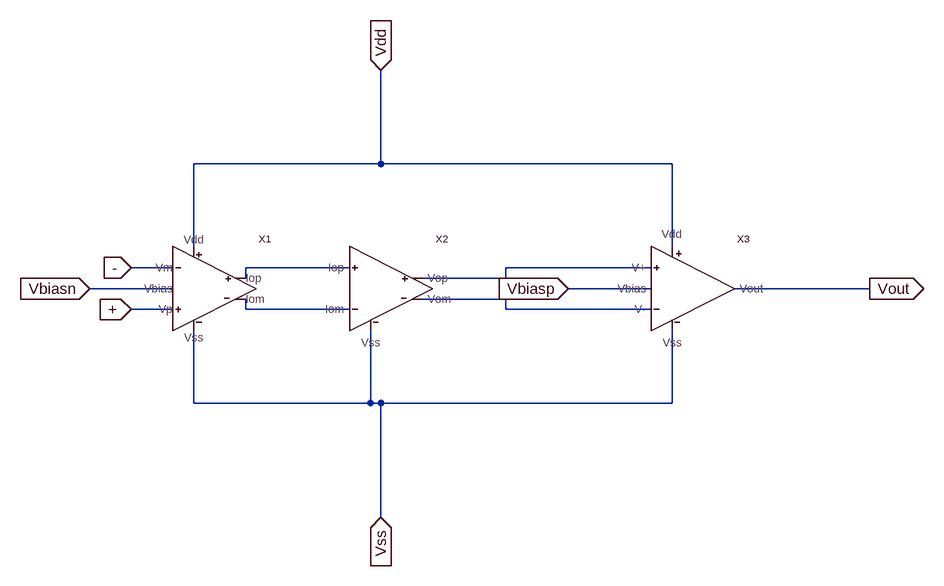
[diagram p0: schematic comparator.asc]
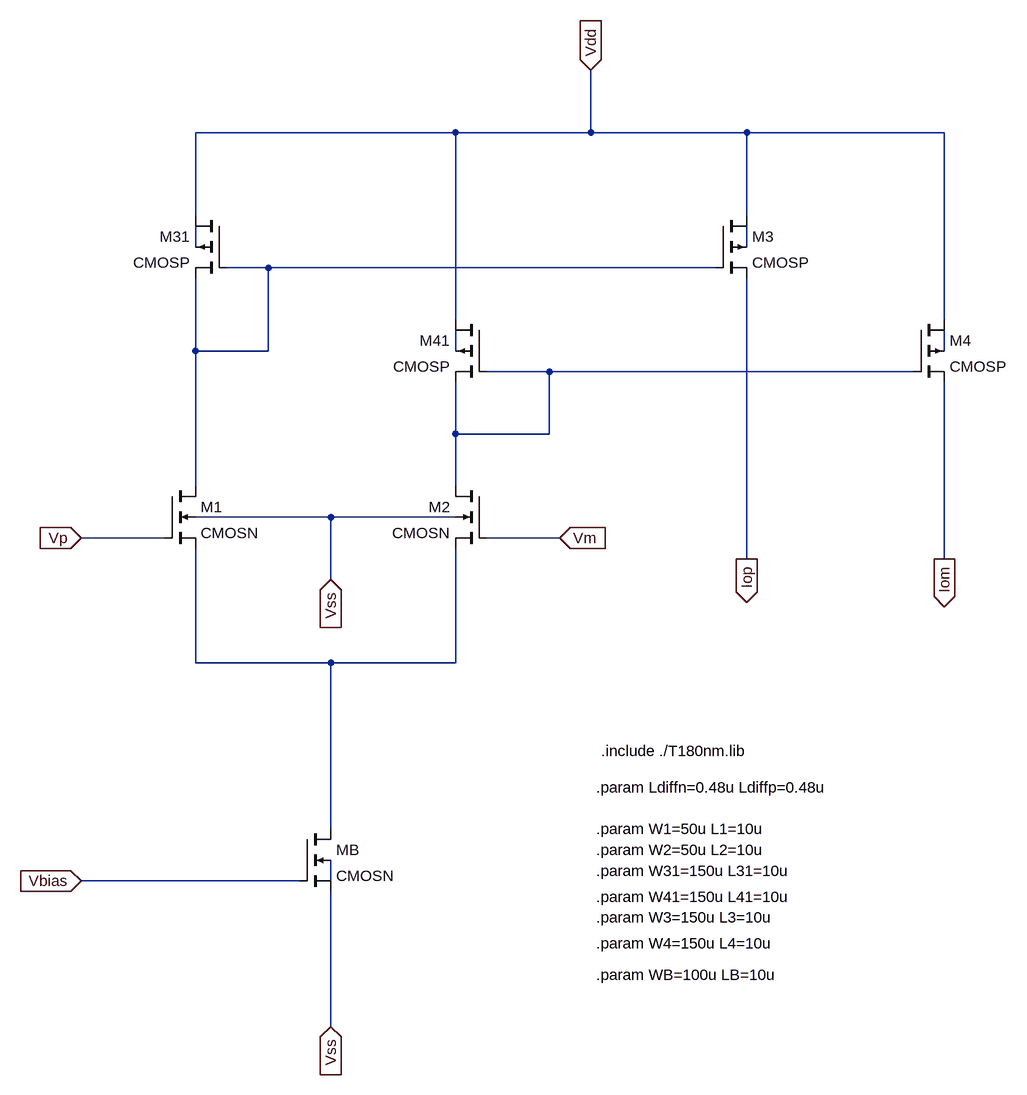
[diagram p1: sub-circuit preamp.asc]
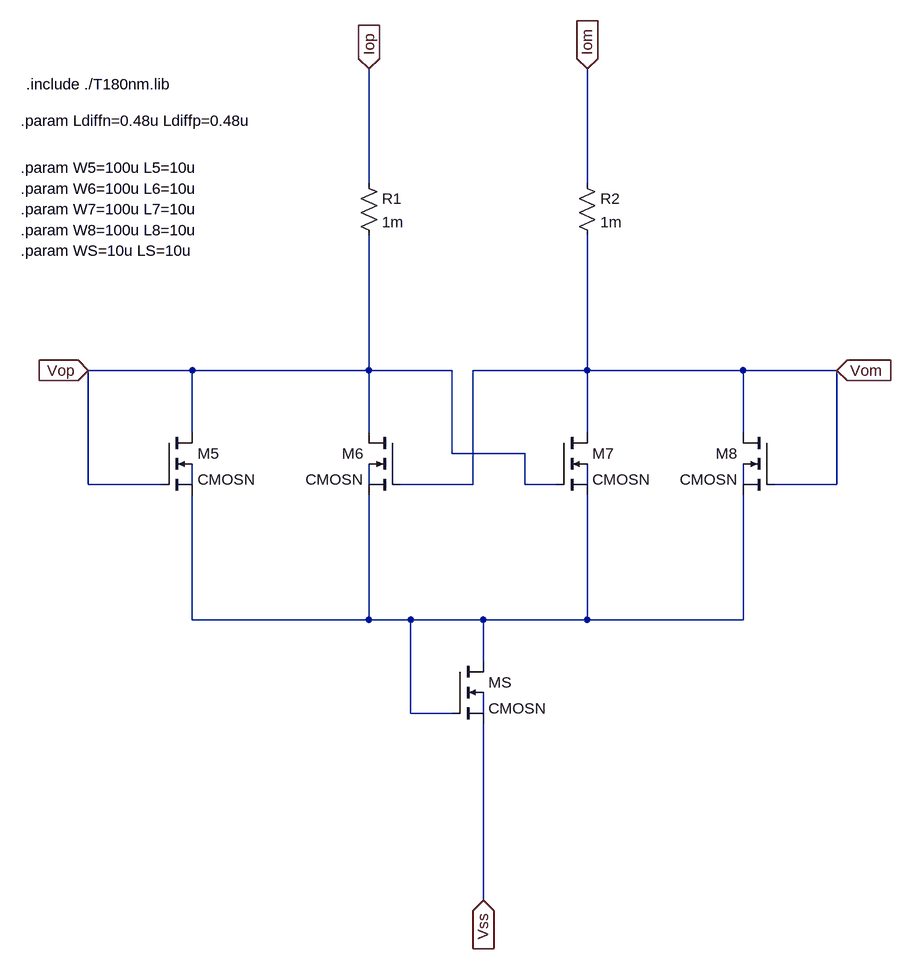
[diagram p2: sub-circuit decision.asc]
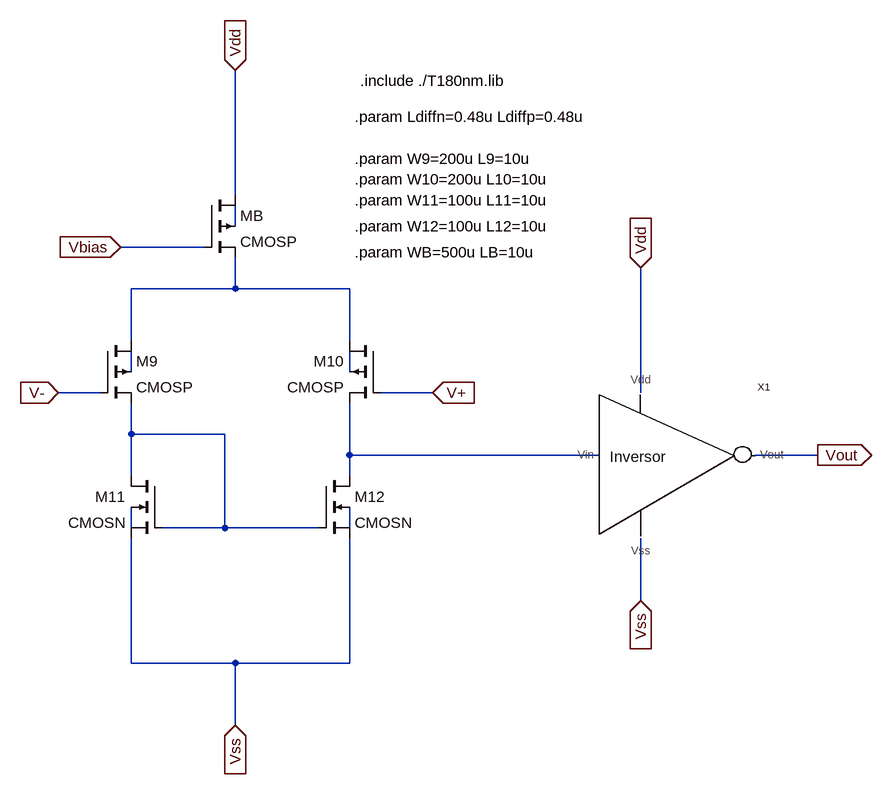
[diagram p3: sub-circuit output_buffer.asc]
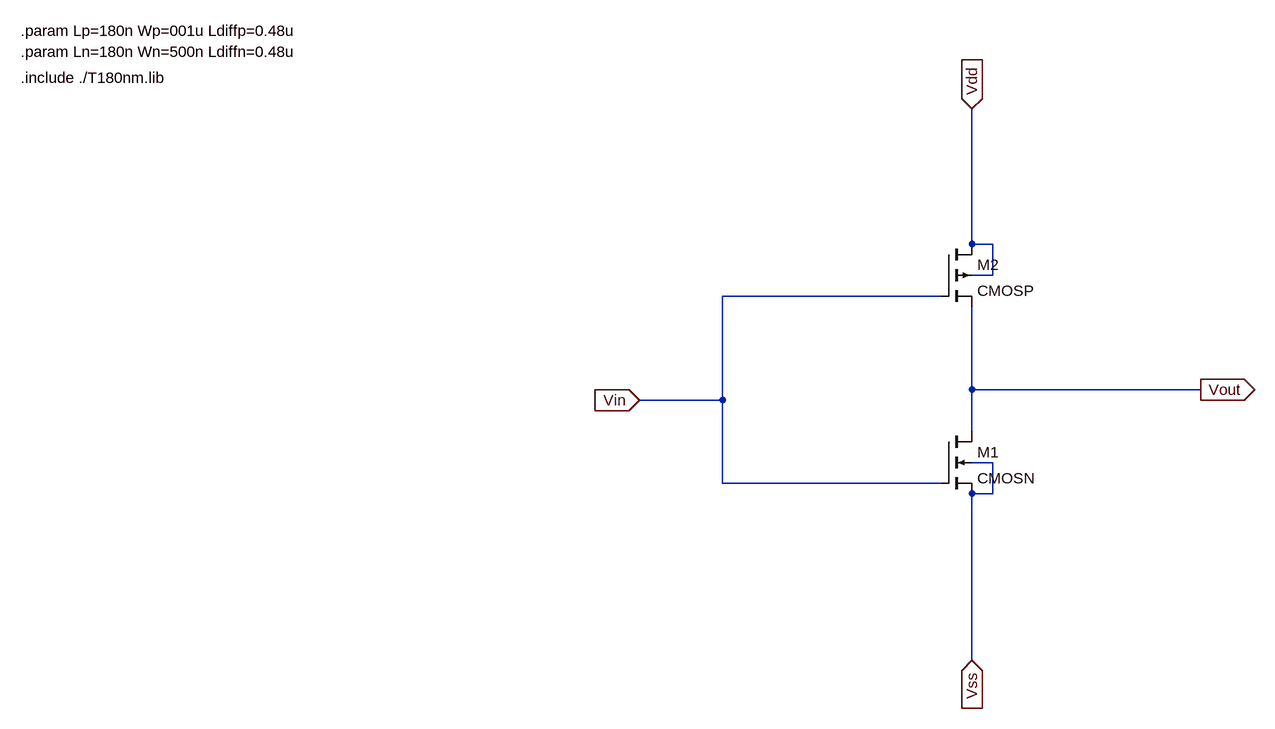
[diagram p4: sub-circuit inversor.asc]
comparator.asc, the LTspice schematic file:
Version 4
SHEET 1 1328 712
WIRE 464 -96 464 -240
WIRE 464 -96 176 -96
WIRE 912 -96 464 -96
WIRE 176 32 176 -96
WIRE 912 32 912 -96
WIRE 144 64 80 64
WIRE 416 64 256 64
WIRE 880 64 656 64
WIRE 256 80 256 64
WIRE 656 80 656 64
WIRE 656 80 528 80
WIRE 144 96 16 96
WIRE 880 96 752 96
WIRE 1216 96 1008 96
WIRE 656 112 528 112
WIRE 144 128 80 128
WIRE 256 128 256 112
WIRE 416 128 256 128
WIRE 656 128 656 112
WIRE 880 128 656 128
WIRE 176 272 176 160
WIRE 448 272 448 160
WIRE 448 272 176 272
WIRE 464 272 448 272
WIRE 912 272 912 160
WIRE 912 272 464 272
WIRE 464 448 464 272
FLAG 1216 96 Vout
IOPIN 1216 96 Out
FLAG 464 -240 Vdd
IOPIN 464 -240 In
FLAG 464 448 Vss
IOPIN 464 448 In
FLAG 80 64 -
IOPIN 80 64 In
FLAG 80 128 +
IOPIN 80 128 In
FLAG 16 96 Vbiasn
IOPIN 16 96 In
FLAG 752 96 Vbiasp
IOPIN 752 96 In
SYMBOL preamp 176 32 R0
SYMATTR InstName X1
SYMBOL decision 464 96 R0
SYMATTR InstName X2
SYMBOL output_buffer 928 96 R0
SYMATTR InstName X3

preamp.asc, the sub-circuit schematic file:
Version 4
SHEET 1 1088 1248
WIRE 240 -224 -160 -224
WIRE 448 -224 448 -320
WIRE 448 -224 240 -224
WIRE 688 -224 448 -224
WIRE 992 -224 688 -224
WIRE -160 -96 -160 -224
WIRE 688 -96 688 -224
WIRE -160 -48 -160 -80
WIRE 688 -48 688 -80
WIRE -48 -16 -112 -16
WIRE 640 -16 -48 -16
WIRE 240 64 240 -224
WIRE 992 64 992 -224
WIRE -160 112 -160 0
WIRE -48 112 -48 -16
WIRE -48 112 -160 112
WIRE 240 112 240 80
WIRE 992 112 992 80
WIRE 384 144 288 144
WIRE 944 144 384 144
WIRE 240 240 240 160
WIRE 384 240 384 144
WIRE 384 240 240 240
WIRE -160 320 -160 112
WIRE 240 320 240 240
WIRE 48 368 -160 368
WIRE 240 368 48 368
WIRE -208 400 -336 400
WIRE 400 400 288 400
WIRE 688 432 688 0
WIRE 992 432 992 160
WIRE 48 464 48 368
WIRE -160 592 -160 416
WIRE 48 592 -160 592
WIRE 240 592 240 416
WIRE 240 592 48 592
WIRE 48 848 48 592
WIRE 0 928 -336 928
WIRE 48 928 48 896
WIRE 48 1152 48 944
FLAG 448 -320 Vdd
IOPIN 448 -320 In
FLAG 48 464 Vss
IOPIN 48 464 In
FLAG -336 400 Vp
IOPIN -336 400 In
FLAG 400 400 Vm
IOPIN 400 400 In
FLAG 48 1152 Vss
IOPIN 48 1152 In
FLAG -336 928 Vbias
IOPIN -336 928 In
FLAG 688 432 Iop
IOPIN 688 432 Out
FLAG 992 432 Iom
IOPIN 992 432 Out
DATAFLAG 48 736 "Id(x2:x1:Mb)"
DATAFLAG -160 256 ""
DATAFLAG 240 272 ""
DATAFLAG 0 592 ""
DATAFLAG 688 320 "Id(x2:x1:M3)"
DATAFLAG 992 320 "Id(x2:x1:M4)"
SYMBOL nmos4 -208 320 R0
SYMATTR InstName M1
SYMATTR Value CMOSN
SYMATTR Value2 l={L1} w={W1} ad={Ldiffn*W1} as={Ldiffn*W1} pd={2*Ldiffn+W1} ps={2*Ldiffn+W1}
SYMBOL pmos4 288 64 M0
SYMATTR InstName M41
SYMATTR Value CMOSP
SYMATTR Value2 l={L41} w={W41} ad={Ldiffp*W41} as={Ldiffp*W41} pd={2*Ldiffp+W41} ps={2*Ldiffp+W41}
SYMBOL nmos4 288 320 M0
SYMATTR InstName M2
SYMATTR Value CMOSN
SYMATTR Value2 l={L2} w={W2} ad={Ldiffn*W2} as={Ldiffn*W2} pd={2*Ldiffn+W2} ps={2*Ldiffn+W2}
SYMBOL pmos4 -112 -96 M0
SYMATTR InstName M31
SYMATTR Value CMOSP
SYMATTR Value2 l={L31} w={W31} ad={Ldiffp*W31} as={Ldiffp*W31} pd={2*Ldiffp+W31} ps={2*Ldiffp+W31}
SYMBOL pmos4 640 -96 R0
SYMATTR InstName M3
SYMATTR Value CMOSP
SYMATTR Value2 l={L3} w={W3} ad={Ldiffp*W3} as={Ldiffp*W3} pd={2*Ldiffp+W3} ps={2*Ldiffp+W3}
SYMBOL pmos4 944 64 R0
SYMATTR InstName M4
SYMATTR Value CMOSP
SYMATTR Value2 l={L4} w={W4} ad={Ldiffp*W4} as={Ldiffp*W4} pd={2*Ldiffp+W4} ps={2*Ldiffp+W4}
SYMBOL nmos4 0 848 R0
SYMATTR InstName MB
SYMATTR Value CMOSN
SYMATTR Value2 l={LB} w={WB} ad={Ldiffn*WB} as={Ldiffn*WB} pd={2*Ldiffn+WB} ps={2*Ldiffn+WB}
TEXT 464 728 Left 2 !.include ./T180nm.lib
TEXT 456 784 Left 2 !.param Ldiffn=0.48u Ldiffp=0.48u
TEXT 456 848 Left 2 !.param W1=50u L1=10u
TEXT 456 880 Left 2 !.param W2=50u L2=10u
TEXT 456 912 Left 2 !.param W31=150u L31=10u
TEXT 456 952 Left 2 !.param W41=150u L41=10u
TEXT 456 984 Left 2 !.param W3=150u L3=10u
TEXT 456 1024 Left 2 !.param W4=150u L4=10u
TEXT 456 1072 Left 2 !.param WB=100u LB=10u

decision.asc, the sub-circuit schematic file:
Version 4
SHEET 1 1240 1248
WIRE 144 -208 144 -384
WIRE 480 -208 480 -384
WIRE -128 80 -288 80
WIRE 144 80 144 -128
WIRE 144 80 -128 80
WIRE 272 80 144 80
WIRE 480 80 480 -128
WIRE 480 80 304 80
WIRE 720 80 480 80
WIRE 864 80 720 80
WIRE -128 176 -128 80
WIRE 144 176 144 80
WIRE 480 176 480 80
WIRE 720 176 720 80
WIRE 272 208 272 80
WIRE 384 208 272 208
WIRE -288 256 -288 80
WIRE -176 256 -288 256
WIRE -128 256 -128 224
WIRE 144 256 144 224
WIRE 304 256 304 80
WIRE 304 256 192 256
WIRE 384 256 384 208
WIRE 432 256 384 256
WIRE 480 256 480 224
WIRE 720 256 720 224
WIRE 864 256 864 80
WIRE 864 256 768 256
WIRE -128 464 -128 272
WIRE 144 464 144 272
WIRE 144 464 -128 464
WIRE 208 464 144 464
WIRE 320 464 208 464
WIRE 480 464 480 272
WIRE 480 464 320 464
WIRE 720 464 720 272
WIRE 720 464 480 464
WIRE 320 528 320 464
WIRE 208 608 208 464
WIRE 272 608 208 608
WIRE 320 608 320 576
WIRE 320 896 320 624
FLAG 144 -384 Iop
IOPIN 144 -384 In
FLAG 480 -384 Iom
IOPIN 480 -384 In
FLAG 320 896 Vss
IOPIN 320 896 In
FLAG -288 80 Vop
IOPIN -288 80 In
FLAG 864 80 Vom
IOPIN 864 80 In
SYMBOL nmos4 192 176 M0
SYMATTR InstName M6
SYMATTR Value CMOSN
SYMATTR Value2 l={L6} w={W6} ad={Ldiffn*W6} as={Ldiffn*W6} pd={2*Ldiffn+W6} ps={2*Ldiffn+W6}
SYMBOL nmos4 768 176 M0
SYMATTR InstName M8
SYMATTR Value CMOSN
SYMATTR Value2 l={L8} w={W8} ad={Ldiffn*W8} as={Ldiffn*W8} pd={2*Ldiffn+W8} ps={2*Ldiffn+W8}
SYMBOL nmos4 432 176 R0
SYMATTR InstName M7
SYMATTR Value CMOSN
SYMATTR Value2 l={L7} w={W7} ad={Ldiffn*W7} as={Ldiffn*W7} pd={2*Ldiffn+W7} ps={2*Ldiffn+W7}
SYMBOL nmos4 -176 176 R0
SYMATTR InstName M5
SYMATTR Value CMOSN
SYMATTR Value2 l={L5} w={W5} ad={Ldiffn*W5} as={Ldiffn*W5} pd={2*Ldiffn+W5} ps={2*Ldiffn+W5}
SYMBOL res 128 -224 R0
SYMATTR InstName R1
SYMATTR Value 1m
SYMBOL res 464 -224 R0
SYMATTR InstName R2
SYMATTR Value 1m
SYMBOL nmos4 272 528 R0
SYMATTR InstName MS
SYMATTR Value CMOSN
SYMATTR Value2 l={LS} w={WS} ad={Ldiffn*WS} as={Ldiffn*WS} pd={2*Ldiffn+WS} ps={2*Ldiffn+WS}
TEXT -384 -360 Left 2 !.include ./T180nm.lib
TEXT -392 -304 Left 2 !.param Ldiffn=0.48u Ldiffp=0.48u
TEXT -392 -232 Left 2 !.param W5=100u L5=10u
TEXT -392 -200 Left 2 !.param W6=100u L6=10u
TEXT -392 -168 Left 2 !.param W7=100u L7=10u
TEXT -392 -136 Left 2 !.param W8=100u L8=10u
TEXT -392 -104 Left 2 !.param WS=10u LS=10u

output_buffer.asc, the sub-circuit schematic file:
Version 4
SHEET 1 1808 1360
WIRE -128 -304 -128 -496
WIRE -128 -256 -128 -288
WIRE -176 -224 -304 -224
WIRE -128 -160 -128 -208
WIRE -128 -160 -288 -160
WIRE 48 -160 -128 -160
WIRE -288 -80 -288 -160
WIRE 48 -80 48 -160
WIRE -288 -32 -288 -64
WIRE 48 -32 48 -64
WIRE -336 0 -400 0
WIRE 176 0 96 0
WIRE 496 0 496 -192
WIRE -288 64 -288 16
WIRE -144 64 -288 64
WIRE 48 96 48 16
WIRE 432 96 48 96
WIRE 768 96 672 96
WIRE -288 128 -288 64
WIRE 48 128 48 96
WIRE -288 208 -288 176
WIRE -144 208 -144 64
WIRE -144 208 -240 208
WIRE 0 208 -144 208
WIRE 48 208 48 176
WIRE 496 320 496 224
WIRE -288 416 -288 224
WIRE -128 416 -288 416
WIRE 48 416 48 224
WIRE 48 416 -128 416
WIRE -128 512 -128 416
FLAG -128 -496 Vdd
IOPIN -128 -496 In
FLAG -304 -224 Vbias
IOPIN -304 -224 In
FLAG -128 512 Vss
IOPIN -128 512 In
FLAG 496 -192 Vdd
IOPIN 496 -192 In
FLAG 496 320 Vss
IOPIN 496 320 In
FLAG 768 96 Vout
IOPIN 768 96 Out
FLAG -400 0 V-
IOPIN -400 0 In
FLAG 176 0 V+
IOPIN 176 0 In
SYMBOL nmos4 -240 128 M0
SYMATTR InstName M11
SYMATTR Value CMOSN
SYMATTR Value2 l={L11} w={W11} ad={Ldiffn*W11} as={Ldiffn*W11} pd={2*Ldiffn+W11} ps={2*Ldiffn+W11}
SYMBOL nmos4 0 128 R0
SYMATTR InstName M12
SYMATTR Value CMOSN
SYMATTR Value2 l={L12} w={W12} ad={Ldiffn*W12} as={Ldiffn*W12} pd={2*Ldiffn+W12} ps={2*Ldiffn+W12}
SYMBOL pmos4 -336 -80 R0
SYMATTR InstName M9
SYMATTR Value CMOSP
SYMATTR Value2 l={L9} w={W9} ad={Ldiffp*W9} as={Ldiffp*W9} pd={2*Ldiffp+W9} ps={2*Ldiffp+W9}
SYMBOL pmos4 -176 -304 R0
SYMATTR InstName MB
SYMATTR Value CMOSP
SYMATTR Value2 l={LB} w={WB} ad={Ldiffp*WB} as={Ldiffp*WB} pd={2*Ldiffp+WB} ps={2*Ldiffp+WB}
SYMBOL pmos4 96 -80 M0
SYMATTR InstName M10
SYMATTR Value CMOSP
SYMATTR Value2 l={L10} w={W10} ad={Ldiffp*W10} as={Ldiffp*W10} pd={2*Ldiffp+W10} ps={2*Ldiffp+W10}
SYMBOL inversor 496 96 R0
SYMATTR InstName X1
TEXT 64 -480 Left 2 !.include ./T180nm.lib
TEXT 56 -424 Left 2 !.param Ldiffn=0.48u Ldiffp=0.48u
TEXT 56 -360 Left 2 !.param W9=200u L9=10u
TEXT 56 -328 Left 2 !.param W10=200u L10=10u
TEXT 56 -296 Left 2 !.param W11=100u L11=10u
TEXT 56 -256 Left 2 !.param W12=100u L12=10u
TEXT 56 -216 Left 2 !.param WB=500u LB=10u

inversor.asc, the sub-circuit schematic file:
Version 4
SHEET 1 880 712
WIRE 224 -96 224 -304
WIRE 256 -96 224 -96
WIRE 256 -48 256 -96
WIRE 256 -48 224 -48
WIRE 176 -16 -160 -16
WIRE 224 128 224 0
WIRE 576 128 224 128
WIRE -160 144 -160 -16
WIRE -160 144 -288 144
WIRE 224 192 224 128
WIRE 256 240 224 240
WIRE -160 272 -160 144
WIRE 176 272 -160 272
WIRE 256 288 256 240
WIRE 256 288 224 288
WIRE 224 544 224 288
FLAG -288 144 Vin
IOPIN -288 144 In
FLAG 576 128 Vout
IOPIN 576 128 Out
FLAG 224 -304 Vdd
IOPIN 224 -304 In
FLAG 224 544 Vss
IOPIN 224 544 In
SYMBOL nmos4 176 192 R0
SYMATTR InstName M1
SYMATTR Value CMOSN
SYMATTR Value2 l={Ln} w={Wn} ad={Ldiffn*Wn} as={Ldiffn*Wn} pd={2*Ldiffn+Wn} ps={2*Ldiffn+Wn}
SYMBOL pmos4 176 -96 R0
SYMATTR InstName M2
SYMATTR Value CMOSP
SYMATTR Value2 l={Lp} w={Wp} ad={Ldiffp*Wp} as={Ldiffp*Wp} pd={2*Ldiffp+Wp} ps={2*Ldiffp+Wp}
TEXT -1240 -352 Left 2 !.include ./T180nm.lib
TEXT -1240 -424 Left 2 !.param Lp=180n Wp=001u Ldiffp=0.48u
TEXT -1240 -392 Left 2 !.param Ln=180n Wn=500n Ldiffn=0.48u

The netlist it stands for:
* comparator.asc
XX1 + - Vdd Vss N001 N004 Vbiasn preamp
XX2 N002 N003 Vss N004 N001 decision
XX3 Vbiasp Vout Vss N003 N002 Vdd output_buffer

* block symbol definitions
.subckt preamp Vp Vm Vdd Vss Iop Iom Vbias
M1 N003 Vp N007 Vss CMOSN l={L1} w={W1} ad={Ldiffn*W1} as={Ldiffn*W1} pd={2*Ldiffn+W1} ps={2*Ldiffn+W1}
M41 Vdd N006 N006 N004 CMOSP l={L41} w={W41} ad={Ldiffp*W41} as={Ldiffp*W41} pd={2*Ldiffp+W41} ps={2*Ldiffp+W41}
M2 N006 Vm N007 Vss CMOSN l={L2} w={W2} ad={Ldiffn*W2} as={Ldiffn*W2} pd={2*Ldiffn+W2} ps={2*Ldiffn+W2}
M31 Vdd N003 N003 N001 CMOSP l={L31} w={W31} ad={Ldiffp*W31} as={Ldiffp*W31} pd={2*Ldiffp+W31} ps={2*Ldiffp+W31}
M3 Vdd N003 Iop N002 CMOSP l={L3} w={W3} ad={Ldiffp*W3} as={Ldiffp*W3} pd={2*Ldiffp+W3} ps={2*Ldiffp+W3}
M4 Vdd N006 Iom N005 CMOSP l={L4} w={W4} ad={Ldiffp*W4} as={Ldiffp*W4} pd={2*Ldiffp+W4} ps={2*Ldiffp+W4}
MB N007 Vbias Vss N008 CMOSN l={LB} w={WB} ad={Ldiffn*WB} as={Ldiffn*WB} pd={2*Ldiffn+WB} ps={2*Ldiffn+WB}
.include ./T180nm.lib
.param Ldiffn=0.48u Ldiffp=0.48u
.param W1=50u L1=10u
.param W2=50u L2=10u
.param W31=150u L31=10u
.param W41=150u L41=10u
.param W3=150u L3=10u
.param W4=150u L4=10u
.param WB=100u LB=10u
.ends preamp

.subckt decision Vop Vom Vss Iom Iop
M6 Vop Vom N005 N002 CMOSN l={L6} w={W6} ad={Ldiffn*W6} as={Ldiffn*W6} pd={2*Ldiffn+W6} ps={2*Ldiffn+W6}
M8 Vom Vom N005 N004 CMOSN l={L8} w={W8} ad={Ldiffn*W8} as={Ldiffn*W8} pd={2*Ldiffn+W8} ps={2*Ldiffn+W8}
M7 Vom Vop N005 N003 CMOSN l={L7} w={W7} ad={Ldiffn*W7} as={Ldiffn*W7} pd={2*Ldiffn+W7} ps={2*Ldiffn+W7}
M5 Vop Vop N005 N001 CMOSN l={L5} w={W5} ad={Ldiffn*W5} as={Ldiffn*W5} pd={2*Ldiffn+W5} ps={2*Ldiffn+W5}
R1 Iop Vop 1m
R2 Iom Vom 1m
MS N005 N005 Vss N006 CMOSN l={LS} w={WS} ad={Ldiffn*WS} as={Ldiffn*WS} pd={2*Ldiffn+WS} ps={2*Ldiffn+WS}
.include ./T180nm.lib
.param Ldiffn=0.48u Ldiffp=0.48u
.param W5=100u L5=10u
.param W6=100u L6=10u
.param W7=100u L7=10u
.param W8=100u L8=10u
.param WS=10u LS=10u
.ends decision

.subckt output_buffer Vbias Vout Vss V- V+ Vdd
M11 N005 N005 Vss N007 CMOSN l={L11} w={W11} ad={Ldiffn*W11} as={Ldiffn*W11} pd={2*Ldiffn+W11} ps={2*Ldiffn+W11}
M12 N006 N005 Vss N008 CMOSN l={L12} w={W12} ad={Ldiffn*W12} as={Ldiffn*W12} pd={2*Ldiffn+W12} ps={2*Ldiffn+W12}
M9 N002 V- N005 N003 CMOSP l={L9} w={W9} ad={Ldiffp*W9} as={Ldiffp*W9} pd={2*Ldiffp+W9} ps={2*Ldiffp+W9}
MB Vdd Vbias N002 N001 CMOSP l={LB} w={WB} ad={Ldiffp*WB} as={Ldiffp*WB} pd={2*Ldiffp+WB} ps={2*Ldiffp+WB}
M10 N002 V+ N006 N004 CMOSP l={L10} w={W10} ad={Ldiffp*W10} as={Ldiffp*W10} pd={2*Ldiffp+W10} ps={2*Ldiffp+W10}
XX1 N006 Vdd Vss Vout inversor
.include ./T180nm.lib
.param Ldiffn=0.48u Ldiffp=0.48u
.param W9=200u L9=10u
.param W10=200u L10=10u
.param W11=100u L11=10u
.param W12=100u L12=10u
.param WB=500u LB=10u
.ends output_buffer

.subckt inversor Vin Vdd Vss Vout
M1 Vout Vin Vss Vss CMOSN l={Ln} w={Wn} ad={Ldiffn*Wn} as={Ldiffn*Wn} pd={2*Ldiffn+Wn} ps={2*Ldiffn+Wn}
M2 Vdd Vin Vout Vdd CMOSP l={Lp} w={Wp} ad={Ldiffp*Wp} as={Ldiffp*Wp} pd={2*Ldiffp+Wp} ps={2*Ldiffp+Wp}
.include ./T180nm.lib
.param Lp=180n Wp=001u Ldiffp=0.48u
.param Ln=180n Wn=500n Ldiffn=0.48u
.ends inversor

.model NMOS NMOS
.model PMOS PMOS
.lib standard.mos
.backanno
.end